# Altium project UNO R4 WiFi.PrjPcb
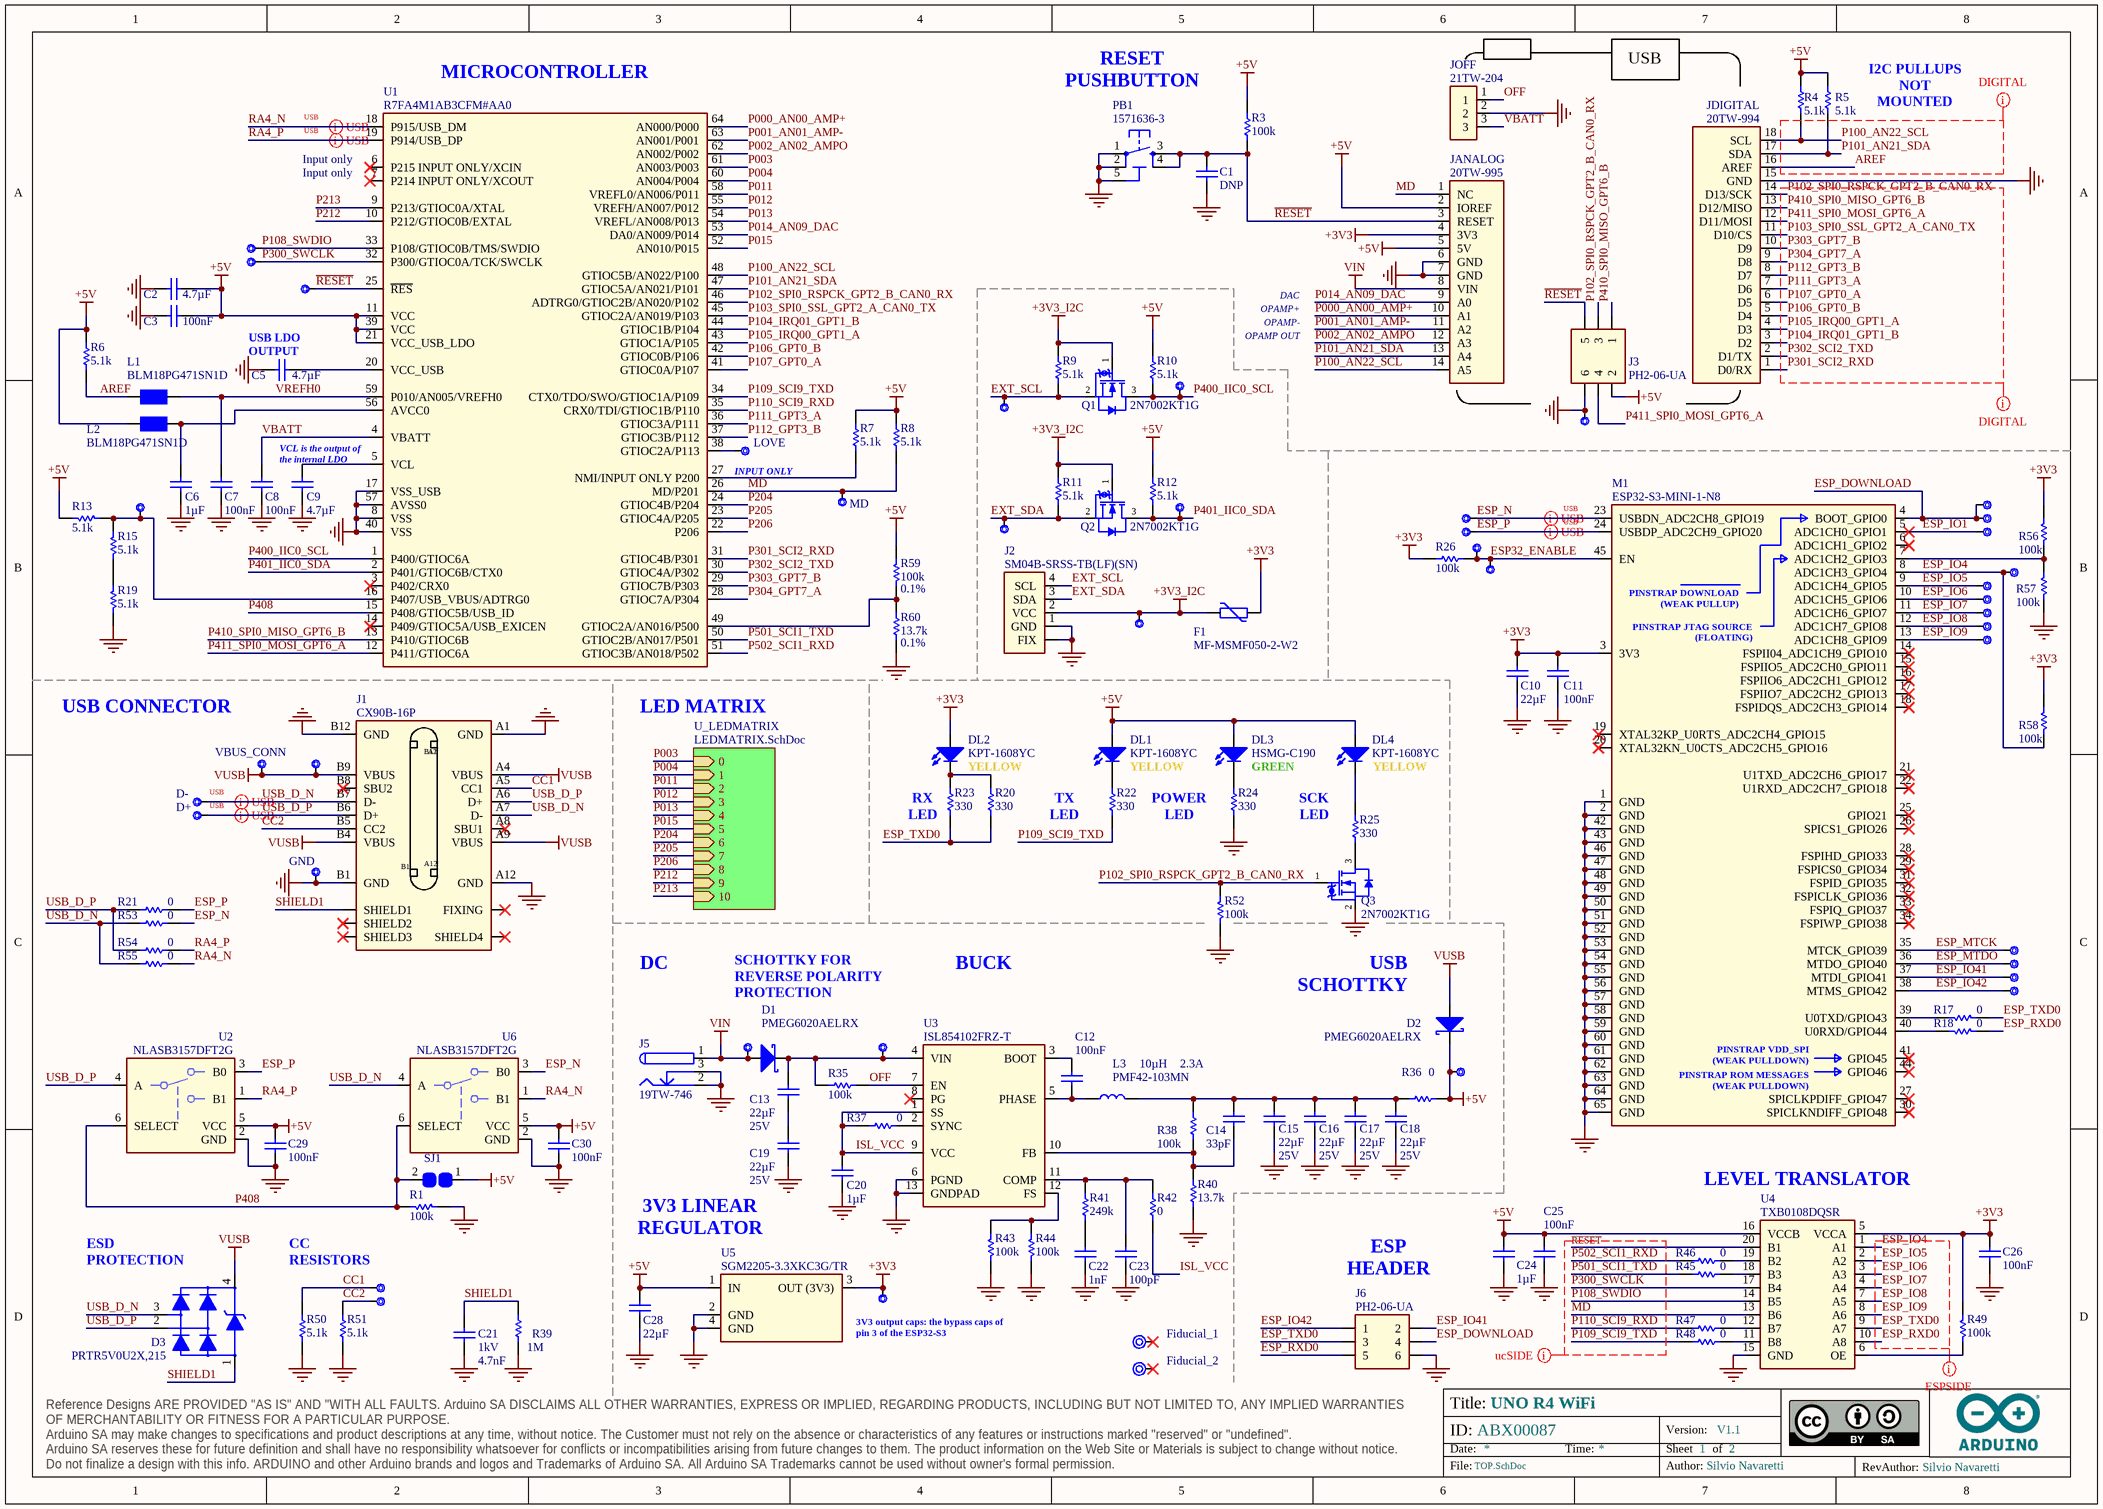
[diagram p0: TOP.SchDoc]
Version: V1.1; VIA_THROUGH_PAD_MM: 0.6; VIA_THROUGH_HOLE_MM: 0.3; VIA_THROUGH: X; VIA_5_PAD_MM: _; VIA_5_HOLE_MM: _; VIA_5: _; VIA_4_PAD_MM: _; VIA_4_HOLE_MM: _; VIA_4: _; VIA_3_PAD_MM: _; VIA_3_HOLE_MM: _; VIA_3: _; VIA_2_PAD_MM: _; VIA_2_HOLE_MM: _; VIA_2: _; VIA_1_PAD_MM: _; VIA_1_HOLE_MM: _; VIA_1: _; TRACK_MIN_WIDTH_OUTER: 0.15mm; TRACK_MIN_WIDTH_INNER: 0.15mm; SKU: ABX00087; PANEL_TABS: _; PANEL_SIZE: 284.7mm x 157.16mm; PANEL_SCORING: X; PANEL_REQUESTED: _; PANEL_PROVIDED: X; PANEL_NUMBER_OF_FIGURES: 10; PANEL_NOT_REQUESTED: _; PANEL_MILLING: X; INSULATION_MIN_OUTER: 0.15mm; INSULATION_MIN_INNER: 0.15mm; FINISH_TBD: _; FINISH_TABS: _; FINISH_SOLDERMASK_TOP: X; FINISH_SOLDERMASK_PEELABLE_TOP: _; FINISH_SOLDERMASK_PEELABLE_COLOR: _; FINISH_SOLDERMASK_PEELABLE_BOTTOM: _; FINISH_SOLDERMASK_COLOR: BLUE; FINISH_SOLDERMASK_BOTTOM: X; FINISH_SN/PB: _; FINISH_SILK_TOP: X; FINISH_SILK_COLOR: WHITE; FINISH_SILK_BOTTOM: X; FINISH_NI/AU: _; FINISH_HAL_LF: _; FINISH_HAL: _; FINISH_ENIG: X; FINISH_EDGE_PLATING: _; FINISH_ADJUSTMENTS: _; DRILLS_SOLDER_FILLING: X; DRILLS_SLOT: _; DRILLS_RESIN_FILLING: _; DRILLS_PRESSFIT: _; DRILLS_LASER: _; DRILLS_FULL: X; DRILLS_COPPER_FILLING: _; DRILLS_BURIED: _; DRILLS_BLIND: _; BOARD_INFO_THICKNESS: 1.6mm; BOARD_INFO_TBD: _; BOARD_INFO_RIGID/FLEX: _; BOARD_INFO_RIGID: X; BOARD_INFO_POLYMIDE: _; BOARD_INFO_PCB_SIZE: 68.58mm x 53.34mm; BOARD_INFO_NUMBER_OF_LAYERS: 4; BOARD_INFO_IPC_NA: X; BOARD_INFO_IPC3: _; BOARD_INFO_IPC2: _; BOARD_INFO_IPC1: _; BOARD_INFO_FR4_HTG: _; BOARD_INFO_FR4: X; BOARD_INFO_FLEX: _; BOARD_INFO_Er: _; BOARD_INFO_AUTHOR: Silvio Navaretti; ASSEMBLY_THT: X; ASSEMBLY_SMD: X; ASSEMBLY_PRESSFIT: _; ASSEMBLY_BGA: _
2 sheets, 257 parts. Net scope: hierarchical (ports join the sheet entries above them; power ports are global).
Board file: PCB.PcbDoc
Sheets:
  TOP.SchDoc
    U_LEDMATRIX = LEDMATRIX.SchDoc

## Sheet TOP.SchDoc: UNO R4 WiFi
size A3; Author: Silvio Navaretti; CompanyName: ARDUINO SRL; DrawnBy: Silvio Navaretti; Engineer: Silvio Navaretti; Organization: ARDUINO SRL; Address1: Via Agostino Da Montefeltro 2 Torino TO, Italy; DocumentNumber: ABX00087; Revision: V1.1; SheetNumber: 1; SheetTotal: 2; RevAuthor: Silvio Navaretti

### Parts
3V3_IC  CMP-018-0004-A.4  [TP-0.8MM]  (value not drawn)  (no BOM)
3V3_TOP  CMP-018-0004-A.4  [TP-0.8MM]  (value not drawn)  (no BOM)
5V_TOP  CMP-018-0004-A.4  [TP-0.8MM]  (value not drawn)  (no BOM)
BUCK_IN_TOP  CMP-018-0004-A.4  [TP-0.8MM]  (value not drawn)  (no BOM)
C1  DNP  [CAP-0402]
C2  value 4.7µF  [CAP-0603]  (hidden comment: GRM188R61C475KAAJD)
C3  value 100nF  [CAP-0402]  (hidden comment: GRM155R61H104KE19D)
C5  value 4.7µF  [CAP-0603]  (hidden comment: GRM188R61C475KAAJD)
C6  value 1µF  [CAP-0402]  (hidden comment: CL05A105KP5NNNC)
C7  value 100nF  [CAP-0402]  (hidden comment: GRM155R61H104KE19D)
C8  value 100nF  [CAP-0402]  (hidden comment: GRM155R61H104KE19D)
C9  value 4.7µF  [CAP-0603]  (hidden comment: GRM188R61C475KAAJD)
C10  value 22µF  [CAP-0805]  (hidden comment: CL21A226MAQNNNE)
C11  value 100nF  [CAP-0402]  (hidden comment: GRM155R61H104KE19D)
C12  value 100nF  [CAP-0402]  (hidden comment: GRM155R61H104KE19D)
C13  value 22µF  Voltage: 25V  [CAP-0805]  (hidden comment: CL21A226MAQNNNE)
C14  value 33pF  [CAP-0402]  (hidden comment: GRM1555C1H330JA01D)
C15  value 22µF  Voltage: 25V  [CAP-0805]  (hidden comment: CL21A226MAQNNNE)
C16  value 22µF  Voltage: 25V  [CAP-0805]  (hidden comment: CL21A226MAQNNNE)
C17  value 22µF  Voltage: 25V  [CAP-0805]  (hidden comment: CL21A226MAQNNNE)
C18  value 22µF  Voltage: 25V  [CAP-0805]  (hidden comment: CL21A226MAQNNNE)
C19  value 22µF  Voltage: 25V  [CAP-0805]  (hidden comment: CL21A226MAQNNNE)
C20  value 1µF  [CAP-0402]  (hidden comment: CL05A105KP5NNNC)
C21  value 4.7nF  Voltage: 1kV  [CAP-0805]  (hidden comment: FV21X472K102ECG)
C22  value 1nF  [CAP-0402]  (hidden comment: GRM155R71H102KA01D)
C23  value 100pF  [CAP-0402]  (hidden comment: CC0402JRNPO9BN101)
C24  value 1µF  [CAP-0402]  (hidden comment: CL05A105KP5NNNC)
C25  value 100nF  [CAP-0402]  (hidden comment: GRM155R61H104KE19D)
C26  value 100nF  [CAP-0402]  (hidden comment: GRM155R61H104KE19D)
C28  value 22µF  [CAP-0805]  (hidden comment: CL21A226MAQNNNE)
C29  value 100nF  [CAP-0402]  (hidden comment: GRM155R61H104KE19D)
C30  value 100nF  [CAP-0402]  (hidden comment: GRM155R61H104KE19D)
CC1  CMP-018-0004-A.4  [TP-0.8MM]  (value not drawn)  (no BOM)
CC2  CMP-018-0004-A.4  [TP-0.8MM]  (value not drawn)  (no BOM)
D1  PMEG6020AELRX  [SOD123-1]
D2  PMEG6020AELRX  [SOD123-1]
D3  PRTR5V0U2X,215  [SOT190P230X110-4N]
D+  CMP-018-0005-A.3  [TP-1.00MM]  (value not drawn)  (no BOM)
D+_TOP  CMP-018-0004-A.4  [TP-0.8MM]  (value not drawn)  (no BOM)
D-  CMP-018-0005-A.3  [TP-1.00MM]  (value not drawn)  (no BOM)
D-_TOP  CMP-018-0004-A.4  [TP-0.8MM]  (value not drawn)  (no BOM)
DL1  KPT-1608YC  [LEDC1608X80N-AK]
DL2  KPT-1608YC  [LEDC1608X80N-AK]
DL3  HSMG-C190  [LEDC1608X80N-AK]
DL4  KPT-1608YC  [LEDC1608X80N-AK]
ESP_DOWNLOAD_BOTTOM1  CMP-018-0005-A.3  [TP-1.00MM]  (value not drawn)  (no BOM)
ESP_DOWNLOAD_TOP  CMP-018-0004-A.4  [TP-0.8MM]  (value not drawn)  (no BOM)
ESP_EN_BOTTOM  CMP-018-0005-A.3  [TP-1.00MM]  (value not drawn)  (no BOM)
ESP_EN_TOP  CMP-018-0004-A.4  [TP-0.8MM]  (value not drawn)  (no BOM)
ESP_IO1  CMP-018-0004-A.4  [TP-0.8MM]  (value not drawn)  (no BOM)
ESP_IO4  CMP-018-0004-A.4  [TP-0.8MM]  (value not drawn)  (no BOM)
ESP_IO5  CMP-018-0004-A.4  [TP-0.8MM]  (value not drawn)  (no BOM)
ESP_IO6  CMP-018-0004-A.4  [TP-0.8MM]  (value not drawn)  (no BOM)
ESP_IO7  CMP-018-0004-A.4  [TP-0.8MM]  (value not drawn)  (no BOM)
ESP_IO8  CMP-018-0004-A.4  [TP-0.8MM]  (value not drawn)  (no BOM)
ESP_IO9  CMP-018-0004-A.4  [TP-0.8MM]  (value not drawn)  (no BOM)
ESP_MTCK  CMP-018-0004-A.4  [TP-0.8MM]  (value not drawn)  (no BOM)
ESP_MTDI  CMP-018-0004-A.4  [TP-0.8MM]  (value not drawn)  (no BOM)
ESP_MTDO  CMP-018-0004-A.4  [TP-0.8MM]  (value not drawn)  (no BOM)
ESP_MTMS  CMP-018-0004-A.4  [TP-0.8MM]  (value not drawn)  (no BOM)
EXT_SCL  CMP-018-0004-A.4  [TP-0.8MM]  (value not drawn)  (no BOM)
EXT_SDA  CMP-018-0004-A.4  [TP-0.8MM]  (value not drawn)  (no BOM)
F1  MF-MSMF050-2-W2  [1812]
Fiducial_1  Fiducial mark 1mm with 2mm solder  [Fiducial mark 1mm with circle-Footprint-1]  (value not drawn)  (no BOM)
Fiducial_2  Fiducial mark 1mm with 2mm solder  [Fiducial mark 1mm with circle-Footprint-1]  (value not drawn)  (no BOM)
GND  CMP-018-0005-A.3  [TP-1.00MM]  (value not drawn)  (no BOM)
GND2  CMP-018-0005-A.3  [TP-1.00MM]  (value not drawn)  (no BOM)
J1  CX90B-16P  [CX90B-16P-Footprint-1]
J2  SM04B-SRSS-TB(LF)(SN)  [SM04B-SRSS-TB(LF)(SN)-Footprint-1]
J3  PH2-06-UA  [2X03]
J5  19TW-746  [POWERSUPPLY_DC-21MM]
J6  PH2-06-UA  [2X03]
JANALOG  20TW-995  [1X14-CUSTOM]
JDIGITAL  20TW-994  [1X18-CUSTOM]
JOFF  21TW-204  [21TW-204]
L1  BLM18PG471SN1D  [L-0603]
L2  BLM18PG471SN1D  [L-0603]
L3  PMF42-103MN  Max DC Current: 2.3A  Inductance: 10µH  [PMF42]
LOVE  CMP-018-0005-A.3  [TP-1.00MM]  (value not drawn)  (no BOM)
M1  ESP32-S3-MINI-1-N8  [ESP32-S3-MINI-1-N8]
MD  CMP-018-0004-A.4  [TP-0.8MM]  (value not drawn)  (no BOM)
P400_SCL  CMP-018-0004-A.4  [TP-0.8MM]  (value not drawn)  (no BOM)
P401_SDA  CMP-018-0004-A.4  [TP-0.8MM]  (value not drawn)  (no BOM)
PB1  1571636-3  [TS42]
Q1  2N7002KT1G  [SOT23]
Q2  2N7002KT1G  [SOT23]
Q3  2N7002KT1G  [SOT23]
R1  value 100k  [RES-0402]  (hidden comment: CRCW0402100KFKEDC)
R3  value 100k  [RES-0402]  (hidden comment: CRCW0402100KFKEDC)
R4  value 5.1k  [RES-0402]  (hidden comment: RC0402FR-075K1L)
R5  value 5.1k  [RES-0402]  (hidden comment: RC0402FR-075K1L)
R6  value 5.1k  [RES-0402]  (hidden comment: RC0402FR-075K1L)
R7  value 5.1k  [RES-0402]  (hidden comment: RC0402FR-075K1L)
R8  value 5.1k  [RES-0402]  (hidden comment: RC0402FR-075K1L)
R9  value 5.1k  [RES-0402]  (hidden comment: RC0402FR-075K1L)
R10  value 5.1k  [RES-0402]  (hidden comment: RC0402FR-075K1L)
R11  value 5.1k  [RES-0402]  (hidden comment: RC0402FR-075K1L)
R12  value 5.1k  [RES-0402]  (hidden comment: RC0402FR-075K1L)
R13  value 5.1k  [RES-0402]  (hidden comment: RC0402FR-075K1L)
R15  value 5.1k  [RES-0402]  (hidden comment: RC0402FR-075K1L)
R17  value 0  [RES-0402]  (hidden comment: CRCW04020000Z0EDC)
R18  value 0  [RES-0402]  (hidden comment: CRCW04020000Z0EDC)
R19  value 5.1k  [RES-0402]  (hidden comment: RC0402FR-075K1L)
R20  value 330  [RES-0402]  (hidden comment: CRCW0402330RJNED)
R21  value 0  [RES-0402]  (hidden comment: CRCW04020000Z0EDC)
R22  value 330  [RES-0402]  (hidden comment: CRCW0402330RJNED)
R23  value 330  [RES-0402]  (hidden comment: CRCW0402330RJNED)
R24  value 330  [RES-0402]  (hidden comment: CRCW0402330RJNED)
R25  value 330  [RES-0402]  (hidden comment: CRCW0402330RJNED)
R26  value 100k  [RES-0402]  (hidden comment: CRCW0402100KFKEDC)
R35  value 100k  [RES-0402]  (hidden comment: CRCW0402100KFKEDC)
R36  value 0  [RES-0402]  (hidden comment: CRCW04020000Z0EDC)
R37  value 0  [RES-0402]  (hidden comment: CRCW04020000Z0EDC)
R38  value 100k  [RES-0402]  (hidden comment: CRCW0402100KFKEDC)
R39  value 1M  [RES-0402]  (hidden comment: CRCW04021M00FKED)
R40  value 13.7k  [RES-0402]  (hidden comment: RC0402FR-0713K7L)
R41  value 249k  [RES-0402]  (hidden comment: AC0402FR-07249KL)
R42  value 0  [RES-0402]  (hidden comment: CRCW04020000Z0EDC)
R43  value 100k  [RES-0402]  (hidden comment: CRCW0402100KFKEDC)
R44  value 100k  [RES-0402]  (hidden comment: CRCW0402100KFKEDC)
R45  value 0  [RES-0402]  (hidden comment: CRCW04020000Z0EDC)
R46  value 0  [RES-0402]  (hidden comment: CRCW04020000Z0EDC)
R47  value 0  [RES-0402]  (hidden comment: CRCW04020000Z0EDC)
R48  value 0  [RES-0402]  (hidden comment: CRCW04020000Z0EDC)
R49  value 100k  [RES-0402]  (hidden comment: CRCW0402100KFKEDC)
R50  value 5.1k  [RES-0402]  (hidden comment: RC0402FR-075K1L)
R51  value 5.1k  [RES-0402]  (hidden comment: RC0402FR-075K1L)
R52  value 100k  [RES-0402]  (hidden comment: CRCW0402100KFKEDC)
R53  value 0  [RES-0402]  (hidden comment: CRCW04020000Z0EDC)
R54  value 0  [RES-0402]  (hidden comment: CRCW04020000Z0EDC)
R55  value 0  [RES-0402]  (hidden comment: CRCW04020000Z0EDC)
R56  value 100k  [RES-0402]  (hidden comment: CRCW0402100KFKEDC)
R57  value 100k  [RES-0402]  (hidden comment: CRCW0402100KFKEDC)
R58  value 100k  [RES-0402]  (hidden comment: CRCW0402100KFKEDC)
R59  value 100k  Tolerance: 0.1%  [RES-0402]  (hidden comment: WF04H1003BT)
R60  value 13.7k  Tolerance: 0.1%  [RES-0402]  (hidden comment: WF04H1372BTL)
RES  CMP-018-0004-A.4  [TP-0.8MM]  (value not drawn)  (no BOM)
SJ1  SMD solder JUMPER 0805  [SJ]  (value not drawn)  (no BOM)
SWCLK  CMP-018-0004-A.4  [TP-0.8MM]  (value not drawn)  (no BOM)
SWDIO  CMP-018-0004-A.4  [TP-0.8MM]  (value not drawn)  (no BOM)
U1  R7FA4M1AB3CFM#AA0  [CQFP50P1200X1200X170-64L]
U2  NLASB3157DFT2G  [TSOP65P210X110-6N]
U3  ISL854102FRZ-T  [QFN0P300X400X100_HS-13L]
U4  TXB0108DQSR  [FP-DQS0020A-MFG]
U5  SGM2205-3.3XKC3G/TR  [SOT223-3]
U6  NLASB3157DFT2G  [TSOP65P210X110-6N]
uC_VBUS  CMP-018-0004-A.4  [TP-0.8MM]  (value not drawn)  (no BOM)
VBUS_CONN  CMP-018-0005-A.3  [TP-1.00MM]  (value not drawn)  (no BOM)
VCONN_TOP  CMP-018-0004-A.4  [TP-0.8MM]  (value not drawn)  (no BOM)
VIN_TOP  CMP-018-0004-A.4  [TP-0.8MM]  (value not drawn)  (no BOM)

### Sub-sheets
U_LEDMATRIX = LEDMATRIX.SchDoc: 0 (in), 1 (in), 2 (in), 3 (in), 4 (in), 5 (in), 6 (in), 7 (in), 8 (in), 9 (in), 10 (in)

### Nets
+3V3: 3V3_TOP.X C10.2 C11.2 C26.2 DL2.A F1.2 JANALOG.4(3V3) M1.3(3V3) R26.1 R49.2 R56.2 R58.2 U4.5(VCCA) U5.3(OUT_(3V3))
+3V3_I2C: 3V3_IC.X F1.1 J2.2(VCC) Q1.1(G) Q2.1(G) R9.1 R11.1
+5V: 5V_TOP.X C2.2 C3.2 C24.2 C25.2 C28.2 C29.2 C30.2 D2.C DL1.A DL3.A DL4.A J3.2 JANALOG.2(IOREF) JANALOG.5(5V) L2.1 R3.2 R4.2 R5.2 R6.2 R7.1 R8.1 R10.1 R12.1 R13.1 R36.2 R59.2 SJ1.1 U1.11(VCC) U1.21(VCC_USB_LDO) U1.39(VCC) U2.5(VCC) U4.16(VCCB) U5.1(IN) U6.5(VCC)
GND: C1.2 C2.1 C3.1 C5.1 C6.2 C7.1 C8.1 C9.1 C10.1 C11.1 C15.1 C16.1 C17.1 C18.1 C19.1 C20.2 C21.1 C22.1 C23.1 C24.1 C25.1 C26.1 C28.1 C29.1 C30.1 GND.X GND2.X J1.A1(GND) J1.A12(GND) J1.B1(GND) J1.B12(GND) J2.1(GND) J2.FIX J3.6 J5.2 J5.3 J6.6 JANALOG.6(GND) JANALOG.7(GND) JDIGITAL.15(GND) JOFF.2 M1.1(GND) M1.2(GND) M1.42(GND) M1.43(GND) M1.46(GND) M1.47(GND) M1.48(GND) M1.49(GND) M1.50(GND) M1.51(GND) M1.52(GND) M1.53(GND) M1.54(GND) M1.55(GND) M1.56(GND) M1.57(GND) M1.58(GND) M1.59(GND) M1.60(GND) M1.61(GND) M1.62(GND) M1.63(GND) M1.64(GND) M1.65(GND) PB1.1 PB1.2 PB1.5(5-GND) Q3.2(S) R1.1 R19.2 R24.1 R39.1 R40.1 R43.1 R44.1 R50.1 R51.1 R52.1 R57.1 R60.1 U1.8(VSS) U1.17(VSS_USB) U1.40(VSS) U1.57(AVSS0) U2.2(GND) U3.6(PGND) U3.13(GNDPAD) U4.15(GND) U5.2(GND) U5.4(GND) U6.2(GND)
VIN: D1.A J5.1 JANALOG.8(VIN) VIN_TOP.X
VUSB: D2.A D3.4 J1.A4(VBUS) J1.A9(VBUS) J1.B4(VBUS) J1.B9(VBUS) VBUS_CONN.X VCONN_TOP.X
AREF: JDIGITAL.16(AREF) L1.1 R6.1  [project net AREF_1]
CC1: CC1.X J1.A5(CC1) R50.2  [project net CC1_1]
CC2: CC2.X J1.B5(CC2) R51.2  [project net CC2_1]
ESP32_ENABLE: ESP_EN_BOTTOM.X ESP_EN_TOP.X M1.45(EN) R26.2  [project net ESP32_ENABLE_1]
ESP_DOWNLOAD: ESP_DOWNLOAD_BOTTOM1.X ESP_DOWNLOAD_TOP.X J6.4 M1.4(BOOT_GPIO0)  [project net ESP_DOWNLOAD_1]
ESP_IO1: ESP_IO1.X M1.5(ADC1CH0_GPIO1)  [project net ESP_IO1_1]
ESP_IO4: ESP_IO4.X M1.8(ADC1CH3_GPIO4) R58.1 U4.1(A1)  [project net ESP_IO4_1]
ESP_IO5: ESP_IO5.X M1.9(ADC1CH4_GPIO5) U4.2(A2)  [project net ESP_IO5_1]
ESP_IO6: ESP_IO6.X M1.10(ADC1CH5_GPIO6) U4.3(A3)  [project net ESP_IO6_1]
ESP_IO7: ESP_IO7.X M1.11(ADC1CH6_GPIO7) U4.4(A4)  [project net ESP_IO7_1]
ESP_IO8: ESP_IO8.X M1.12(ADC1CH7_GPIO8) U4.7(A5)  [project net ESP_IO8_1]
ESP_IO9: ESP_IO9.X M1.13(ADC1CH8_GPIO9) U4.8(A6)  [project net ESP_IO9_1]
ESP_IO41: ESP_MTDI.X J6.2 M1.37(MTDI_GPIO41)  [project net ESP_IO41_1]
ESP_IO42: ESP_MTMS.X J6.1 M1.38(MTMS_GPIO42)  [project net ESP_IO42_1]
ESP_MTCK: ESP_MTCK.X M1.35(MTCK_GPIO39)  [project net ESP_MTCK_1]
ESP_MTDO: ESP_MTDO.X M1.36(MTDO_GPIO40)  [project net ESP_MTDO_1]
ESP_N: D-_TOP.X M1.23(USBDN_ADC2CH8_GPIO19) R53.1 U6.3(B0)  [project net ESP_N_1]
ESP_P: D+_TOP.X M1.24(USBDP_ADC2CH9_GPIO20) R21.1 U2.3(B0)  [project net ESP_P_1]
ESP_RXD0: J6.5 R18.1 U4.10(A8)  [project net ESP_RXD0_1]
ESP_TXD0: J6.3 R17.1 R20.1 R23.1 U4.9(A7)  [project net ESP_TXD0_1]
EXT_SCL: EXT_SCL.X J2.4(SCL) Q1.2(S) R9.2  [project net EXT_SCL_1]
EXT_SDA: EXT_SDA.X J2.3(SDA) Q2.2(S) R11.2  [project net EXT_SDA_1]
ISL_VCC: C20.1 R37.2 R42.2 U3.1(SS) U3.9(VCC)  [project net ISL_VCC_1]
MD: JANALOG.1(NC) MD.X R8.2 U1.26(MD/P201) U4.13(B6)  [project net MD_1]
OFF: JOFF.1 R35.2 U3.7(EN)  [project net OFF_1]
P000_AN00_AMP+: JANALOG.10(A1) U1.64(AN000/P000)  [project net P000_AN00_AMP+_1]
P001_AN01_AMP-: JANALOG.11(A2) U1.63(AN001/P001)  [project net P001_AN01_AMP-_1]
P002_AN02_AMPO: JANALOG.12(A3) U1.62(AN002/P002)  [project net P002_AN02_AMPO_1]
P003: U1.61(AN003/P003) ; sheet U_LEDMATRIX/0
P004: U1.60(AN004/P004) ; sheet U_LEDMATRIX/1
P011: U1.58(VREFL0/AN006/P011) ; sheet U_LEDMATRIX/2
P012: U1.55(VREFH/AN007/P012) ; sheet U_LEDMATRIX/3
P013: U1.54(VREFL/AN008/P013) ; sheet U_LEDMATRIX/4
P014_AN09_DAC: JANALOG.9(A0) U1.53(DA0/AN009/P014)  [project net P014_AN09_DAC_1]
P015: U1.52(AN010/P015) ; sheet U_LEDMATRIX/5
P100_AN22_SCL: JANALOG.14(A5) JDIGITAL.18(SCL) R4.1 U1.48(GTIOC5B/AN022/P100)  [project net P100_AN22_SCL_1]
P101_AN21_SDA: JANALOG.13(A4) JDIGITAL.17(SDA) R5.1 U1.47(GTIOC5A/AN021/P101)  [project net P101_AN21_SDA_1]
P102_SPI0_RSPCK_GPT2_B_CAN0_RX: J3.3 JDIGITAL.14(D13/SCK) Q3.1(G) R52.2 U1.46(ADTRG0/GTIOC2B/AN020/P102)  [project net P102_SPI0_RSPCK_GPT2_B_CAN0_RX_1]
P103_SPI0_SSL_GPT2_A_CAN0_TX: JDIGITAL.11(D10/CS) U1.45(GTIOC2A/AN019/P103)  [project net P103_SPI0_SSL_GPT2_A_CAN0_TX_1]
P104_IRQ01_GPT1_B: JDIGITAL.3(D2) U1.44(GTIOC1B/P104)  [project net P104_IRQ01_GPT1_B_1]
P105_IRQ00_GPT1_A: JDIGITAL.4(D3) U1.43(GTIOC1A/P105)  [project net P105_IRQ00_GPT1_A_1]
P106_GPT0_B: JDIGITAL.5(D4) U1.42(GTIOC0B/P106)  [project net P106_GPT0_B_1]
P107_GPT0_A: JDIGITAL.6(D5) U1.41(GTIOC0A/P107)  [project net P107_GPT0_A_1]
P108_SWDIO: SWDIO.X U1.33(P108/GTIOC0B/TMS/SWDIO) U4.14(B5)  [project net P108_SWDIO_1]
P109_SCI9_TXD: R22.1 R48.1 U1.34(CTX0/TDO/SWO/GTIOC1A/P109)  [project net P109_SCI9_TXD_1]
P110_SCI9_RXD: R47.1 U1.35(CRX0/TDI/GTIOC1B/P110)  [project net P110_SCI9_RXD_1]
P111_GPT3_A: JDIGITAL.7(D6) U1.36(GTIOC3A/P111)  [project net P111_GPT3_A_1]
P112_GPT3_B: JDIGITAL.8(D7) U1.37(GTIOC3B/P112)  [project net P112_GPT3_B_1]
P204: U1.24(GTIOC4B/P204) ; sheet U_LEDMATRIX/6
P205: U1.23(GTIOC4A/P205) ; sheet U_LEDMATRIX/7
P206: U1.22(P206) ; sheet U_LEDMATRIX/8
P212: U1.10(P212/GTIOC0B/EXTAL) ; sheet U_LEDMATRIX/9
P213: U1.9(P213/GTIOC0A/XTAL) ; sheet U_LEDMATRIX/10
P300_SWCLK: SWCLK.X U1.32(P300/GTIOC0A/TCK/SWCLK) U4.17(B4)  [project net P300_SWCLK_1]
P301_SCI2_RXD: JDIGITAL.1(D0/RX) U1.31(GTIOC4B/P301)  [project net P301_SCI2_RXD_1]
P302_SCI2_TXD: JDIGITAL.2(D1/TX) U1.30(GTIOC4A/P302)  [project net P302_SCI2_TXD_1]
P303_GPT7_B: JDIGITAL.10(D9) U1.29(GTIOC7B/P303)  [project net P303_GPT7_B_1]
P304_GPT7_A: JDIGITAL.9(D8) U1.28(GTIOC7A/P304)  [project net P304_GPT7_A_1]
P400_IIC0_SCL: P400_SCL.X Q1.3(D) R10.2 U1.1(P400/GTIOC6A)  [project net P400_IIC0_SCL_1]
P401_IIC0_SDA: P401_SDA.X Q2.3(D) R12.2 U1.2(P401/GTIOC6B/CTX0)  [project net P401_IIC0_SDA_1]
P408: R1.2 SJ1.2 U1.15(P408/GTIOC5B/USB_ID) U2.6(SELECT) U6.6(SELECT)  [project net P408_1]
P410_SPI0_MISO_GPT6_B: J3.1 JDIGITAL.13(D12/MISO) U1.13(P410/GTIOC6B)  [project net P410_SPI0_MISO_GPT6_B_1]
P411_SPI0_MOSI_GPT6_A: J3.4 JDIGITAL.12(D11/MOSI) U1.12(P411/GTIOC6A)  [project net P411_SPI0_MOSI_GPT6_A_1]
P501_SCI1_TXD: R45.1 U1.50(GTIOC2B/AN017/P501)  [project net P501_SCI1_TXD_1]
P502_SCI1_RXD: R46.1 U1.51(GTIOC3B/AN018/P502)  [project net P502_SCI1_RXD_1]
~{RESET}: C1.1 J3.5 JANALOG.3(RESET) PB1.3 PB1.4 R3.1 RES.X U1.25(~{RES}) U4.20(B1)  [project net ~{RESET}_1]
RA4_N: R55.1 U1.18(P915/USB_DM) U6.1(B1)  [project net RA4_N_1]
RA4_P: R54.1 U1.19(P914/USB_DP) U2.1(B1)  [project net RA4_P_1]
SHIELD1: C21.2 D3.1 J1.SHIELD1 R39.2  [project net SHIELD1_1]
USB_D_N: D3.3 D-.X J1.A7(D-) J1.B7(D-) R53.2 R55.2 U6.4(A)  [project net USB_D_N_1]
USB_D_P: D3.2 D+.X J1.A6(D+) J1.B6(D+) R21.2 R54.2 U2.4(A)  [project net USB_D_P_1]
VBATT: C8.2 JOFF.3 U1.4(VBATT)  [project net VBATT_1]
VREFH0: C7.2 L1.2 U1.59(P010/AN005/VREFH0)  [project net VREFH0_1]
NetBUCK_IN_TOP_X: BUCK_IN_TOP.X C13.2 D1.C R35.1 U3.4(VIN)
NetC5_2: C5.2 U1.20(VCC_USB)
NetC6_1: C6.1 L2.2 U1.56(AVCC0)
NetC9_2: C9.2 U1.5(VCL)
NetC12_1: C12.1 L3.1 U3.5(PHASE)
NetC12_2: C12.2 U3.3(BOOT)
NetC13_1: C13.1 C19.2
NetC14_1: C14.1 R38.2 R40.2 U3.10(FB)
NetC14_2: C14.2 C15.2 C16.2 C17.2 C18.2 L3.2 R36.1 R38.1
NetC22_2: C22.2 R41.1
NetC23_2: C23.2 R41.2 R42.1 U3.11(COMP)
NetDL1_C: DL1.C R22.2
NetDL2_C: DL2.C R20.2 R23.2
NetDL3_C: DL3.C R24.2
NetDL4_C: DL4.C R25.2
NetLOVE_X: LOVE.X U1.38(GTIOC2A/P113)
NetM1_7: M1.7(ADC1CH2_GPIO3) R56.1 R57.2
NetM1_39: M1.39(U0TXD/GPIO43) R17.2
NetM1_40: M1.40(U0RXD/GPIO44) R18.2
NetQ3_3: Q3.3(D) R25.1
NetR7_2: R7.2 U1.27(NMI/INPUT_ONLY_P200)
NetR13_2: R13.2 R15.2 U1.16(P407/USB_VBUS/ADTRG0) uC_VBUS.X
NetR15_1: R15.1 R19.1
NetR37_1: R37.1 U3.2(SYNC)
NetR43_2: R43.2 R44.2 U3.12(FS)
NetR45_2: R45.2 U4.18(B3)
NetR46_2: R46.2 U4.19(B2)
NetR47_2: R47.2 U4.12(B7)
NetR48_2: R48.2 U4.11(B8)
NetR49_1: R49.1 U4.6(OE)
NetR59_1: R59.1 R60.2 U1.49(GTIOC2A/AN016/P500)

Not connected (* = marked no-connect by the designer): Fiducial_1 1*; Fiducial_2 1*; J1 A8(SBU1)* B8(SBU2)* FIXING* SHIELD2* SHIELD3* SHIELD4*; M1 6(ADC1CH1_GPIO2)* 14(FSPII04_ADC1CH9_GPIO10)* 15(FSPIIO5_ADC2CH0_GPIO11)* 16(FSPIIO6_ADC2CH1_GPIO12)* 17(FSPIIO7_ADC2CH2_GPIO13)* 18(FSPIDQS_ADC2CH3_GPIO14)* 19(XTAL32KP_U0RTS_ADC2CH4_GPIO15)* 20(XTAL32KN_U0CTS_ADC2CH5_GPIO16)* 21(U1TXD_ADC2CH6_GPIO17)* 22(U1RXD_ADC2CH7_GPIO18)* 25(GPIO21)* 26(SPICS1_GPIO26)* 27(SPICLKPDIFF_GPIO47)* 28(FSPIHD_GPIO33)* 29(FSPICS0_GPIO34)* 30(SPICLKNDIFF_GPIO48)* 31(FSPID_GPIO35)* 32(FSPICLK_GPIO36)* 33(FSPIQ_GPIO37)* 34(FSPIWP_GPIO38)* 41(GPIO45)* 44(GPIO46)*; U1 3(P402/CRX0)* 6(P215_INPUT_ONLY/XCIN)* 7(P214_INPUT_ONLY/XCOUT)* 14(P409/GTIOC5A/USB_EXICEN)*; U3 8(PG)*

### Layout directives
net class ucSIDE: MD, P108_SWDIO, P109_SCI9_TXD, P110_SCI9_RXD, P300_SWCLK, P501_SCI1_TXD, P502_SCI1_RXD, ~{RESET}
net class DIGITAL: AREF, P100_AN22_SCL, P101_AN21_SDA, P102_SPI0_RSPCK_GPT2_B_CAN0_RX, P103_SPI0_SSL_GPT2_A_CAN0_TX, P104_IRQ01_GPT1_B, P105_IRQ00_GPT1_A, P106_GPT0_B, P107_GPT0_A, P111_GPT3_A, P112_GPT3_B, P301_SCI2_RXD, P302_SCI2_TXD, P303_GPT7_B, P304_GPT7_A, P410_SPI0_MISO_GPT6_B, P411_SPI0_MOSI_GPT6_A
differential pair; differential pair class USB: ESP_N_1, ESP_P_1, RA4_N_1, RA4_P_1, USB_D_N_1, USB_D_P_1
net class espSIDE: ESP_IO4, ESP_IO5, ESP_IO6, ESP_IO7, ESP_IO8, ESP_IO9, ESP_RXD0, ESP_TXD0

### Notes on the sheet
- (near U1) MICROCONTROLLER
- (near R3) RESET PUSHBUTTON
- USB
- (near R5) I2C PULLUPS
  NOT MOUNTED
- (near U1) Input only
- DAC
- OPAMP+
- (near C5) USB LDO OUTPUT
- OPAMP-
- OPAMP OUT
- VCL is the output of the internal LDO
- (near LOVE) INPUT ONLY
- (near VBUS_CONN) USB CONNECTOR
- (near U1) LED MATRIX
- YELLOW
- GREEN
- (near DL4) YELLOW
- (near R23) RX LED
- TX LED
- (near R24) POWER LED
- (near R25) SCK LED
- DC JACK
- BUCK CONVERTER
- SCHOTTKY FOR REVERSE POLARITY PROTECTION
- USB SCHOTTKY
- LEVEL TRANSLATOR
- 3V3 LINEAR REGULATOR
- (near D3) ESD
  PROTECTION
- (near CC1) CC RESISTORS
- ESP HEADER
- 3V3 output caps: the bypass caps of pin 3 of the ESP32-S3
- Title:
- ID:
- Date:
- Time:
- Version:
- Sheet
- of
- RevAuthor:
- Reference Designs ARE PROVIDED "AS IS" AND "WITH ALL FAULTS. Arduino SA DISCLAIMS ALL OTHER WARRANTIES, EXPRESS OR IMPLIED, REGARDING PRODUCTS, INCLUDING BUT NOT LIMITED TO, ANY IMPLIED WARRANTIES OF MERCHANTABILITY OR FITNESS FOR A PARTICULAR PURPOSE.
  Arduino SA may make changes to specifications and product descriptions at any time, without notice. The Customer must not rely on the absence or characteristics of any features or instructions marked "reserved" or "undefined".
  Arduino SA reserves these for future definition and shall have no responsibility whatsoever for conflicts or incompatibilities arising from future changes to them. The product information on the Web Site or Materials is subject to change without notice.
  Do not finalize a design with this info. ARDUINO and other Arduino brands and logos and Trademarks of Arduino SA. All Arduino SA Trademarks cannot be used without owner's formal permission.
- File:
- Author:
- (in symbol M0017-A.7) PINSTRAP DOWNLOAD / (WEAK PULLUP); PINSTRAP JTAG SOURCE / (FLOATING); PINSTRAP VDD_SPI / (WEAK PULLDOWN); PINSTRAP ROM MESSAGES / (WEAK PULLDOWN)

### Library data of the parts
3V3_IC 3V3_TOP 5V_TOP BUCK_IN_TOP CC1 CC2 D+_TOP D-_TOP ESP_DOWNLOAD_TOP ESP_EN_TOP ESP_IO1 ESP_IO4-ESP_IO9 ESP_MTCK ESP_MTDI ESP_MTDO ESP_MTMS EXT_SCL EXT_SDA MD P400_SCL P401_SDA RES SWCLK SWDIO uC_VBUS VCONN_TOP VIN_TOP = UT0012-A.4: Test point 0.8mm; Design Item ID: CMP-018-0004-A.4; Source: ut.SchLib; Pin Count: 1
C1 = UT0021-A.3: Package: 0402; Part Number: DNP
C2 C5 C9 = C0054-A.16: CAP CHIP 0603 4.7uF 10% 16V X5R; Manufacturer: Murata; Code Arduino: A5072; Tolerance: 10%; Case Code (Imperial): 0603; Voltage: 16V; Manufacturer 2: Murata; Part Number: GRM188R61C475KAAJD; Dielectric: X5R; Technology: Ceramic; Part number 3: CL10A475KO8NNNC; Part number 2: GRM188R61C475KE11D; Manufacturer 3: Samsung Electro-Mechanics
C3 C7 C8 C11 C12 C25 C26 C29 C30 = C0015-A.14: CAP CHIP 0402 100nF 10% 50V X5R; Manufacturer: Murata; Code Arduino: A5141; Tolerance: 10%; Case Code (Imperial): 0402; Dielectric: X5R; Voltage: 50V; Part Number: GRM155R61H104KE19D; Technology: Ceramic
C6 C20 C24 = C0017-A.14: CAP CHIP 0402 1uF 10% 10V X5R; Manufacturer: Samsung Electro-Mechanics; Code Arduino: 0133; Manufacturer 2: Murata Electronics; Tolerance: 10%; Part Number: CL05A105KP5NNNC; Dielectric: X5R; Voltage: 10V; Case Code (Imperial): 0402; Technology: Ceramic; Part number 2: GCM155C71A105KE38D
C10 C13 C15-C19 C28 = C0111-A.7: CAP CHIP 0805 22uF 20% 25V X5R; Manufacturer: Samsung Electro-Mechanics; Code Arduino: C0111; Case Code (Imperial): 0805; Tolerance: 20%; Dielectric: X5R; Part Number: CL21A226MAQNNNE; Technology: Ceramic
  C10 C28: Voltage: 25V
C14 = C0034-A.14: CAP CHIP 0402 33pF 5% 50V C0G; Manufacturer: Murata; Code Arduino: A5494; Dielectric: C0G; Voltage: 50V; Tolerance: 5%; Part Number: GRM1555C1H330JA01D; Case Code (Imperial): 0402; Technology: Ceramic
C21 = C0059-A.14: CAP CHIP 0805 4.7nF 10% 1000V X7R; Manufacturer: PSA Shenzen; Code Arduino: 0689; Manufacturer 2: KEMET; Tolerance: 10%; Case Code (Imperial): 0805; Part Number: FV21X472K102ECG; Dielectric: X7R; Part number 2: C0805V472KDRACTU; Part number 3: C0805C472KDRACTU; Manufacturer 3: KEMET; Technology: Ceramic
C22 = C0007-A.15: CAP CHIP 0402 1nF 10% 50V X7R; Manufacturer: KEMET; Code Arduino: 2321; Tolerance: 10%; Case Code (Imperial): 0402; Dielectric: X7R; Voltage: 50V; Part Number: GRM155R71H102KA01D; Technology: Ceramic
C23 = C0013-A.4: CAP CHIP 0402 100pF 10% 50V C0G; Manufacturer: Yageo; Code Arduino: C0013; Tolerance: 5%; Case Code (Imperial): 0402; Dielectric: C0G; Part Number: CC0402JRNPO9BN101; Voltage: 50V; Technology: Ceramic
D1 D2 = D0026-A.6: DIODE SCHOTTKY SMD 2A 60V SOD123FL; Manufacturer: Nexperia; Manucturer Part Number 2: SS26L; Code Arduino: 2208; Forward Voltage: 0.6V; Manucturer 2: Hottech; RoHS Compliance: RoHS3; Part Number: PMEG6020AELRX; Device Type: Diode Schottky; Forward Current: 2A
D3 = D0025-A.5: TVS ARRAY 4LIN.8kV 1pF SOT143B; Manufacturer: Nexperia; Device Type: ESD protection; Code Arduino: 2209; Part Number: PRTR5V0U2X,215
D+ D- ESP_DOWNLOAD_BOTTOM1 ESP_EN_BOTTOM GND GND2 LOVE VBUS_CONN = UT0013-A.4: Test point 1.00mm; Source: ut.SchLib; Design Item ID: CMP-018-0005-A.3; Pin Count: 1
DL1 DL2 DL4 = L0008-A.5: LED SMD 0603 GIA588   8mcd 120^; Manufacturer: Kingbright; Code Arduino: 2243; Part Number: KPT-1608YC; Pin Count: 2
DL3 = L0009-A.5: LED SMD 0603 GREEN/568 15mcd 120^; Manufacturer: Broadcom; Code Arduino: 2204; Part Number: HSMG-C190; Pin Count: 2
F1 = P0002-A.7: PTC RESET FUSE 15V 500MA 1812 LOGO OO ARDUINO; Manufacturer: Bourns; Approvals: UL,CSA,TUV; Time to Trip: 0.15s; Max Current Rating: 100A; Trip Current: 1A; Resistance: 150mR; Code Arduino: 3335; Power Dissipation: 800mW; Part Number: MF-MSMF050-2-W2; Hold Current: 500mA; Operating Supply Voltage: 15V; Contact Plating: Gold; Case Code (Metric): 4532; Min Operating Temperature: -40°C; Packaging: Tape and Reel; Max Operating Temperature: 85°C; Radiation Hardening: No; Voltage Rating (DC): 15V; Termination: SMD/SMT; Number of Terminals: 2; Terminal Material: Gold; Voltage Rating: 15V; Width: 3.41mm; Case Code (Imperial): 1812; Length: 4.73mm; Current Rating: 100A; REACH SVHC: No SVHC; Package Quantity: 2000; Lead Free: Lead Free; Case/Package: 1812; Height: 0.85mm; Mount: Surface Mount,PCB
Fiducial_1 Fiducial_2 = UT0024-A.6
J1 = J0272-A.3: CONN RCPT USB3.1 TYPEC 16POS SMD; Manufacturer: Hirose; Code Arduino: J0272; Part Number: CX90B-16P
J2 = J0005-A.2: CONN JST 4POS SIDE 1MM TIN QWIIC; Code Arduino: J0005; Part Number: SM04B-SRSS-TB(LF)(SN); Manufacturer: JST
J3 J6 = J0004-A.5: CONN Header Through Hole 6 position 0.100" (2.54mm); Manufacturer: Adam Tech; Code Arduino: 0114; Part Number: PH2-06-UA
J5 = J0236-A.5: CONN PWR JACK 2.1X5.5MM SOLDER; Manufacturer: 4UCON; Code Arduino: 0018; Part Number: 19TW-746
JANALOG = J0063-A.7: CONN STRIP F/1/D 14v SER.NERA s1pin; Manufacturer: 4UCONN; Code Arduino: 3649; Part Number: 20TW-995; Pin Count: 14
JDIGITAL = J0035-A.10: CONN STRIP F/1/D 18v SER.NERA s1pin; Manufacturer: 4UCONN; Code Arduino: 3648; Part Number: 20TW-994
JOFF = J0184-A.7: CONN HEADER VERT 3POS 2.54MM; Manufacturer: 4UCONN; Number of Contacts: 3; Insulation Resistance: 1GR; Connector Type: BOARD CONNECTOR; Contact Resistance: 20mR; Code Arduino: J0184; Max Operating Temperature: 125°C; Min Operating Temperature: -40°C; Termination: Solder; Contact Material: Copper Alloy; Insulation Color: Black; Mount: Board; Part Number: 21TW-204
L1 L2 = I0006-A.5: FERRITE SMD 0603 470R 1A 0.2R; Manufacturer: Murata; Test Frequency: 100MHz; Code Arduino: 2200; Tolerance: 25%; DC Resistance (DCR): 200mR; Part Number: BLM18PG471SN1D; Case Code (Imperial): 0603; Max DC Current: 1A; Min Operating Temperature: -55°C; Case Code (Metric): 1608; Package Quantity: 1; Current: 1A; Device Type: Ferrite; Max Operating Temperature: 125°C; Packaging: Tape and Reel
L3 = I0072-A.3: IND 10uH 20%, max 235mR, IDC 2.3A, Isat 2.3A, shielded, max 5MHz, 4.5x4.5x1.8mm; Manufacturer: K-WELL; DC Resistance (DCR): 235m; Code Arduino: I0072; Part Number: PMF42-103MN; Current: 2.3A; Frequency: 5MHz; Tolerance: 20%
M1 = M0017-A.7: MODULE ESP32-S3 dual core 32b Xtensa LX7, WiFi 2.4GHz, BLE 5 LE, internal 8MB QSPI flash, no internal PSRAM, PCB antenna, max 85°C, 15.4x20.5x2.4mm; Manufacturer: Espressif; Code Arduino: M0017; Part Number: ESP32-S3-MINI-1-N8
PB1 = B0005-A.8: PUSHBUTTON SMD 6x6 5 PINS; Manufacturer: TE Connectivity; Code Arduino: 0946; Part Number: 1571636-3; Manufacturer Part Number 2: TS42031-160WWS027260; Manufacturer 2: C&K
Q1-Q3 = T0004-A.7: MOSFET N-CH 60V 300mA ESD prot. SOT23; Manufacturer: On Semiconductor; Device Type: Mosfet N-CH SMD; Code Arduino: A5393; Manufacturer 2: Hottech; Pin Count: 3; Manufacturer Part Number 2: 2N7002K; Part Number: 2N7002KT1G
R1 R3 R43 R44 R49 R52 R56-R58 = R0001-A.23: RES CHIP 0402 100k 1% 1/16W; Manufacturer: Vishay; Code Arduino: 0134; Power: 62.5mW; Temperature coefficient: 100ppm; Part Number: CRCW0402100KFKEDC; Tolerance: 1%; Case Code (Imperial): 0402; Technology: Thick film
R4-R13 R15 R19 = R0210-A.18: RES CHIP 0402 5k1 1% 1/16W; Manufacturer: YAGEO; Power: 63mW; Code Arduino: R0210; Temperature coefficient: 100ppm; Tolerance: 1%; Part Number: RC0402FR-075K1L; Case Code (Imperial): 0402; Technology: Thick film
R17 R18 R21 R37 R42 R45-R48 R53-R55 = R0000-A.23: RES CHIP 0402 0R 1/16W; Manufacturer: Vishay; Code Arduino: 0039; Power: 62.5mW; Tolerance: 0%; Temperature coefficient: 0ppm; Case Code (Imperial): 0402; Part Number: CRCW04020000Z0EDC; Technology: Thick film
R20 R22-R25 = R0017-A.23: RES CHIP 0402 330R 5% 1/16W; Manufacturer: Vishay; Code Arduino: 2229; Power: 62.5mW; Temperature coefficient: 200ppm; Part Number: CRCW0402330RJNED; Tolerance: 5%; Case Code (Imperial): 0402; Technology: Thick film
R26 R35 R38 = R0001-A.23: RES CHIP 0402 100k 1% 1/16W; Manufacturer: Vishay; Power: 62.5mW; Code Arduino: 0134; Temperature coefficient: 100ppm; Case Code (Imperial): 0402; Tolerance: 1%; Part Number: CRCW0402100KFKEDC; Technology: Thick film
R36 = R0000-A.23: RES CHIP 0402 0R 1/16W; Manufacturer: Vishay; Code Arduino: 0039; Tolerance: 0%; Power: 62.5mW; Temperature coefficient: 0ppm; Part Number: CRCW04020000Z0EDC; Case Code (Imperial): 0402; Technology: Thick film
R39 = R0058-A.23: RES CHIP 0402 1M 1% 1/16W; Manufacturer: Vishay; Power: 62.5mW; Code Arduino: 0139; Temperature coefficient: 100ppm; Case Code (Imperial): 0402; Tolerance: 1%; Part Number: CRCW04021M00FKED; Technology: Thick film
R40 = R0233-A.9: RES CHIP 0402 13k7 1% 1/16W; Manufacturer: YAGEO; Power: 62.5mW; Code Arduino: R0233; Temperature coefficient: 100ppm; Tolerance: 1%; Part Number: RC0402FR-0713K7L; Case Code (Imperial): 0402; Technology: Thick film
R41 = R0234-A.8: RES CHIP 0402 249k 1% 1/16W; Manufacturer: YAGEO; Code Arduino: R0234; Power: 62.5mW; Temperature coefficient: 100ppm; Tolerance: 1%; Part Number: AC0402FR-07249KL; Case Code (Imperial): 0402; Technology: Thick film
R50 R51 = R0210-A.18: RES CHIP 0402 5k1 1% 1/16W; Manufacturer: YAGEO; Code Arduino: R0210; Power: 63mW; Temperature coefficient: 100ppm; Part Number: RC0402FR-075K1L; Tolerance: 1%; Case Code (Imperial): 0402; Technology: Thick film
R59 = R0247-A.4: RES CHIP 0402 100k 0.1% 100ppm 1/16W; Manufacturer: Walsin; Code Arduino: R0247; Power: 62.5mW; Part Number: WF04H1003BT; Case Code (Imperial): 0402; Temperature coefficient: 100ppm; Technology: Thick film
R60 = R0248-A.3: RES CHIP 0402 13k7 0.1% 100PPM 1/16W; Manufacturer: Walsin; Power: 62.5mW; Code Arduino: R0248; Temperature coefficient: 200ppm; Part Number: WF04H1372BTL; Case Code (Imperial): 0402; Technology: Thick film
SJ1 = UT0002-A.5: Solder Jumper 0805 THIS IS NOT A COMPONENT; Code Arduino: This is not a component
U1 = U0274-A.7: IC uC RA4M1 32b M4 48MHz 254KB flash 32KB RAM 105°C LQFP64 10x10mm; Manufacturer: Renesas; Code Arduino: U0274; Part Number: R7FA4M1AB3CFM#AA0
U2 U6 = U0174-A.2: IC SPDT,max 25R at VCC 4.5V tPD 1.2ns VCC 1.65V to 5V Iq max 10uA SOT363; Manufacturer: ON Semiconductor; Code Arduino: U0174; Part Number: NLASB3157DFT2G
U3 = U0275-A.5: IC BUCK Vin 40V Iout 1.2A 2MHz 12DFN 3x4mm; Manufacturer: Renesas; Code Arduino: U0275; Part Number: ISL854102FRZ-T
U4 = U0276-A.5: IC TRANSLATOR LEVEL SHIFTER BIDIR 8BIT 20SON; Manufacturer: Texas Instruments; Code Arduino: U0276; Part Number: TXB0108DQSR
U5 = U0289-A.2: IC LINEAR REGULATOR Vout 3V3 fixed Vin max 20V Iout max 800mA Pd 1.32W; Manufacturer: SGMICRO; Code Arduino: U0289; Part Number: SGM2205-3.3XKC3G/TR

## Sheet LEDMATRIX.SchDoc: LED MATRIX
size A4; Author: Silvio Navaretti; CompanyName: ARDUINO SRL; DrawnBy: Silvio Navaretti; Engineer: Silvio Navaretti; Organization: ARDUINO SRL; DocumentNumber: ABX00087; Revision: V1.1; SheetNumber: 2; SheetTotal: 2; RevAuthor: Silvio Navaretti
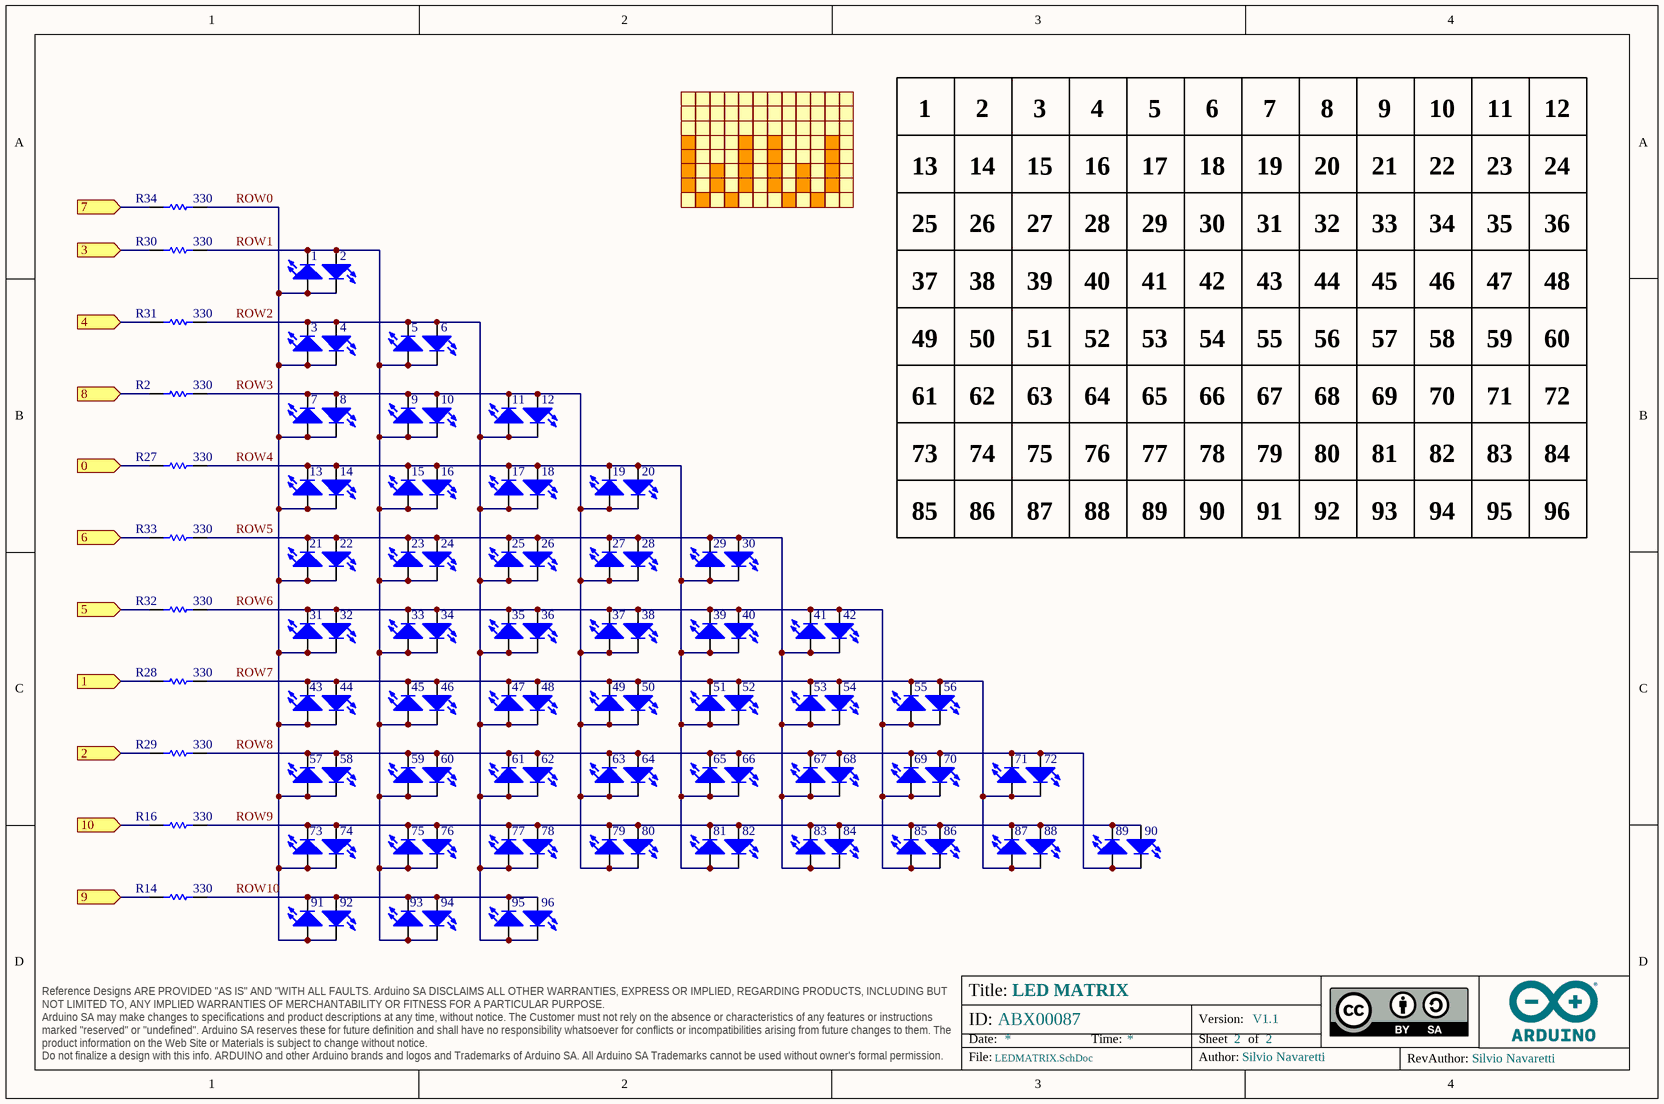
[diagram p1: LEDMATRIX.SchDoc]

### Parts
1  XHY-STB0603SR  [LEDC1608X80N-AK]  (value not drawn)
2  XHY-STB0603SR  [LEDC1608X80N-AK]  (value not drawn)
3  XHY-STB0603SR  [LEDC1608X80N-AK]  (value not drawn)
4  XHY-STB0603SR  [LEDC1608X80N-AK]  (value not drawn)
5  XHY-STB0603SR  [LEDC1608X80N-AK]  (value not drawn)
6  XHY-STB0603SR  [LEDC1608X80N-AK]  (value not drawn)
7  XHY-STB0603SR  [LEDC1608X80N-AK]  (value not drawn)
8  XHY-STB0603SR  [LEDC1608X80N-AK]  (value not drawn)
9  XHY-STB0603SR  [LEDC1608X80N-AK]  (value not drawn)
10  XHY-STB0603SR  [LEDC1608X80N-AK]  (value not drawn)
11  XHY-STB0603SR  [LEDC1608X80N-AK]  (value not drawn)
12  XHY-STB0603SR  [LEDC1608X80N-AK]  (value not drawn)
13  XHY-STB0603SR  [LEDC1608X80N-AK]  (value not drawn)
14  XHY-STB0603SR  [LEDC1608X80N-AK]  (value not drawn)
15  XHY-STB0603SR  [LEDC1608X80N-AK]  (value not drawn)
16  XHY-STB0603SR  [LEDC1608X80N-AK]  (value not drawn)
17  XHY-STB0603SR  [LEDC1608X80N-AK]  (value not drawn)
18  XHY-STB0603SR  [LEDC1608X80N-AK]  (value not drawn)
19  XHY-STB0603SR  [LEDC1608X80N-AK]  (value not drawn)
20  XHY-STB0603SR  [LEDC1608X80N-AK]  (value not drawn)
21  XHY-STB0603SR  [LEDC1608X80N-AK]  (value not drawn)
22  XHY-STB0603SR  [LEDC1608X80N-AK]  (value not drawn)
23  XHY-STB0603SR  [LEDC1608X80N-AK]  (value not drawn)
24  XHY-STB0603SR  [LEDC1608X80N-AK]  (value not drawn)
25  XHY-STB0603SR  [LEDC1608X80N-AK]  (value not drawn)
26  XHY-STB0603SR  [LEDC1608X80N-AK]  (value not drawn)
27  XHY-STB0603SR  [LEDC1608X80N-AK]  (value not drawn)
28  XHY-STB0603SR  [LEDC1608X80N-AK]  (value not drawn)
29  XHY-STB0603SR  [LEDC1608X80N-AK]  (value not drawn)
30  XHY-STB0603SR  [LEDC1608X80N-AK]  (value not drawn)
31  XHY-STB0603SR  [LEDC1608X80N-AK]  (value not drawn)
32  XHY-STB0603SR  [LEDC1608X80N-AK]  (value not drawn)
33  XHY-STB0603SR  [LEDC1608X80N-AK]  (value not drawn)
34  XHY-STB0603SR  [LEDC1608X80N-AK]  (value not drawn)
35  XHY-STB0603SR  [LEDC1608X80N-AK]  (value not drawn)
36  XHY-STB0603SR  [LEDC1608X80N-AK]  (value not drawn)
37  XHY-STB0603SR  [LEDC1608X80N-AK]  (value not drawn)
38  XHY-STB0603SR  [LEDC1608X80N-AK]  (value not drawn)
39  XHY-STB0603SR  [LEDC1608X80N-AK]  (value not drawn)
40  XHY-STB0603SR  [LEDC1608X80N-AK]  (value not drawn)
41  XHY-STB0603SR  [LEDC1608X80N-AK]  (value not drawn)
42  XHY-STB0603SR  [LEDC1608X80N-AK]  (value not drawn)
43  XHY-STB0603SR  [LEDC1608X80N-AK]  (value not drawn)
44  XHY-STB0603SR  [LEDC1608X80N-AK]  (value not drawn)
45  XHY-STB0603SR  [LEDC1608X80N-AK]  (value not drawn)
46  XHY-STB0603SR  [LEDC1608X80N-AK]  (value not drawn)
47  XHY-STB0603SR  [LEDC1608X80N-AK]  (value not drawn)
48  XHY-STB0603SR  [LEDC1608X80N-AK]  (value not drawn)
49  XHY-STB0603SR  [LEDC1608X80N-AK]  (value not drawn)
50  XHY-STB0603SR  [LEDC1608X80N-AK]  (value not drawn)
51  XHY-STB0603SR  [LEDC1608X80N-AK]  (value not drawn)
52  XHY-STB0603SR  [LEDC1608X80N-AK]  (value not drawn)
53  XHY-STB0603SR  [LEDC1608X80N-AK]  (value not drawn)
54  XHY-STB0603SR  [LEDC1608X80N-AK]  (value not drawn)
55  XHY-STB0603SR  [LEDC1608X80N-AK]  (value not drawn)
56  XHY-STB0603SR  [LEDC1608X80N-AK]  (value not drawn)
57  XHY-STB0603SR  [LEDC1608X80N-AK]  (value not drawn)
58  XHY-STB0603SR  [LEDC1608X80N-AK]  (value not drawn)
59  XHY-STB0603SR  [LEDC1608X80N-AK]  (value not drawn)
60  XHY-STB0603SR  [LEDC1608X80N-AK]  (value not drawn)
61  XHY-STB0603SR  [LEDC1608X80N-AK]  (value not drawn)
62  XHY-STB0603SR  [LEDC1608X80N-AK]  (value not drawn)
63  XHY-STB0603SR  [LEDC1608X80N-AK]  (value not drawn)
64  XHY-STB0603SR  [LEDC1608X80N-AK]  (value not drawn)
65  XHY-STB0603SR  [LEDC1608X80N-AK]  (value not drawn)
66  XHY-STB0603SR  [LEDC1608X80N-AK]  (value not drawn)
67  XHY-STB0603SR  [LEDC1608X80N-AK]  (value not drawn)
68  XHY-STB0603SR  [LEDC1608X80N-AK]  (value not drawn)
69  XHY-STB0603SR  [LEDC1608X80N-AK]  (value not drawn)
70  XHY-STB0603SR  [LEDC1608X80N-AK]  (value not drawn)
71  XHY-STB0603SR  [LEDC1608X80N-AK]  (value not drawn)
72  XHY-STB0603SR  [LEDC1608X80N-AK]  (value not drawn)
73  XHY-STB0603SR  [LEDC1608X80N-AK]  (value not drawn)
74  XHY-STB0603SR  [LEDC1608X80N-AK]  (value not drawn)
75  XHY-STB0603SR  [LEDC1608X80N-AK]  (value not drawn)
76  XHY-STB0603SR  [LEDC1608X80N-AK]  (value not drawn)
77  XHY-STB0603SR  [LEDC1608X80N-AK]  (value not drawn)
78  XHY-STB0603SR  [LEDC1608X80N-AK]  (value not drawn)
79  XHY-STB0603SR  [LEDC1608X80N-AK]  (value not drawn)
80  XHY-STB0603SR  [LEDC1608X80N-AK]  (value not drawn)
81  XHY-STB0603SR  [LEDC1608X80N-AK]  (value not drawn)
82  XHY-STB0603SR  [LEDC1608X80N-AK]  (value not drawn)
83  XHY-STB0603SR  [LEDC1608X80N-AK]  (value not drawn)
84  XHY-STB0603SR  [LEDC1608X80N-AK]  (value not drawn)
85  XHY-STB0603SR  [LEDC1608X80N-AK]  (value not drawn)
86  XHY-STB0603SR  [LEDC1608X80N-AK]  (value not drawn)
87  XHY-STB0603SR  [LEDC1608X80N-AK]  (value not drawn)
88  XHY-STB0603SR  [LEDC1608X80N-AK]  (value not drawn)
89  XHY-STB0603SR  [LEDC1608X80N-AK]  (value not drawn)
90  XHY-STB0603SR  [LEDC1608X80N-AK]  (value not drawn)
91  XHY-STB0603SR  [LEDC1608X80N-AK]  (value not drawn)
92  XHY-STB0603SR  [LEDC1608X80N-AK]  (value not drawn)
93  XHY-STB0603SR  [LEDC1608X80N-AK]  (value not drawn)
94  XHY-STB0603SR  [LEDC1608X80N-AK]  (value not drawn)
95  XHY-STB0603SR  [LEDC1608X80N-AK]  (value not drawn)
96  XHY-STB0603SR  [LEDC1608X80N-AK]  (value not drawn)
R2  value 330  [RES-0402]  (hidden comment: CRCW0402330RJNED)
R14  value 330  [RES-0402]  (hidden comment: CRCW0402330RJNED)
R16  value 330  [RES-0402]  (hidden comment: CRCW0402330RJNED)
R27  value 330  [RES-0402]  (hidden comment: CRCW0402330RJNED)
R28  value 330  [RES-0402]  (hidden comment: CRCW0402330RJNED)
R29  value 330  [RES-0402]  (hidden comment: CRCW0402330RJNED)
R30  value 330  [RES-0402]  (hidden comment: CRCW0402330RJNED)
R31  value 330  [RES-0402]  (hidden comment: CRCW0402330RJNED)
R32  value 330  [RES-0402]  (hidden comment: CRCW0402330RJNED)
R33  value 330  [RES-0402]  (hidden comment: CRCW0402330RJNED)
R34  value 330  [RES-0402]  (hidden comment: CRCW0402330RJNED)

### Ports
0 (in), 1 (in), 2 (in), 3 (in), 4 (in), 5 (in), 6 (in), 7 (in), 8 (in), 9 (in), 10 (in)

### Nets
P003: R27.2 ; port 0
P004: R28.2 ; port 1
P011: R29.2 ; port 2
P012: R30.2 ; port 3
P013: R31.2 ; port 4
P015: R32.2 ; port 5
P204: R33.2 ; port 6
P205: R34.2 ; port 7
P206: R2.2 ; port 8
P212: R14.2 ; port 9
P213: R16.2 ; port 10
ROW0: 1.A 2.C 3.A 4.C 7.A 8.C 13.A 14.C 21.A 22.C 31.A 32.C 43.A 44.C 57.A 58.C 73.A 74.C 91.A 92.C R34.1  [project net ROW0_2]
ROW1: 1.C 2.A 5.A 6.C 9.A 10.C 15.A 16.C 23.A 24.C 33.A 34.C 45.A 46.C 59.A 60.C 75.A 76.C 93.A 94.C R30.1  [project net ROW1_2]
ROW2: 3.C 4.A 5.C 6.A 11.A 12.C 17.A 18.C 25.A 26.C 35.A 36.C 47.A 48.C 61.A 62.C 77.A 78.C 95.A 96.C R31.1  [project net ROW2_2]
ROW3: 7.C 8.A 9.C 10.A 11.C 12.A 19.A 20.C 27.A 28.C 37.A 38.C 49.A 50.C 63.A 64.C 79.A 80.C R2.1  [project net ROW3_2]
ROW4: 13.C 14.A 15.C 16.A 17.C 18.A 19.C 20.A 29.A 30.C 39.A 40.C 51.A 52.C 65.A 66.C 81.A 82.C R27.1  [project net ROW4_2]
ROW5: 21.C 22.A 23.C 24.A 25.C 26.A 27.C 28.A 29.C 30.A 41.A 42.C 53.A 54.C 67.A 68.C 83.A 84.C R33.1  [project net ROW5_2]
ROW6: 31.C 32.A 33.C 34.A 35.C 36.A 37.C 38.A 39.C 40.A 41.C 42.A 55.A 56.C 69.A 70.C 85.A 86.C R32.1  [project net ROW6_2]
ROW7: 43.C 44.A 45.C 46.A 47.C 48.A 49.C 50.A 51.C 52.A 53.C 54.A 55.C 56.A 71.A 72.C 87.A 88.C R28.1  [project net ROW7_2]
ROW8: 57.C 58.A 59.C 60.A 61.C 62.A 63.C 64.A 65.C 66.A 67.C 68.A 69.C 70.A 71.C 72.A 89.A 90.C R29.1  [project net ROW8_2]
ROW9: 73.C 74.A 75.C 76.A 77.C 78.A 79.C 80.A 81.C 82.A 83.C 84.A 85.C 86.A 87.C 88.A 89.C 90.A R16.1  [project net ROW9_2]
ROW10: 91.C 92.A 93.C 94.A 95.C 96.A R14.1  [project net ROW10_2]

### Notes on the sheet
- 1
- 2
- 3
- 4
- 5
- 6
- 7
- 8
- 9
- 10
- 11
- 12
- 13
- 14
- 15
- 16
- 17
- 18
- 19
- 20
- 21
- 22
- 23
- 24
- 25
- 26
- 27
- 28
- 29
- 30
- 31
- 32
- 33
- 34
- 35
- 36
- 37
- 38
- 39
- 40
- 41
- 42
- 43
- 44
- 45
- 46
- 47
- 48
- 49
- 61
- 50
- 62
- 51
- 63
- 52
- 64
- 53
- 65
- 54
- 66
- 55
- 67
- 56
- 68
- 57
- 69
- 58
- 70
- 59
- 71
- 60
- 72
- 73
- 74
- 75
- 76
- 77
- 78
- 79
- 80
- 81
- 82
- 83
- 84
- 85
- 86
- 87
- 88
- 89
- 90
- 91
- 92
- 93
- 94
- 95
- 96
- Title:
- ID:
- Date:
- Time:
- Version:
- Sheet
- of
- RevAuthor:
- Reference Designs ARE PROVIDED "AS IS" AND "WITH ALL FAULTS. Arduino SA DISCLAIMS ALL OTHER WARRANTIES, EXPRESS OR IMPLIED, REGARDING PRODUCTS, INCLUDING BUT NOT LIMITED TO, ANY IMPLIED WARRANTIES OF MERCHANTABILITY OR FITNESS FOR A PARTICULAR PURPOSE.
  Arduino SA may make changes to specifications and product descriptions at any time, without notice. The Customer must not rely on the absence or characteristics of any features or instructions marked "reserved" or "undefined". Arduino SA reserves these for future definition and shall have no responsibility whatsoever for conflicts or incompatibilities arising from future changes to them. The product information on the Web Site or Materials is subject to change without notice.
  Do not finalize a design with this info. ARDUINO and other Arduino brands and logos and Trademarks of Arduino SA. All Arduino SA Trademarks cannot be used without owner's formal permission.
- File:
- Author:

### Library data of the parts
1-96 = L0024-A.4: LED SMD 0603 RED 625nm, water clear, 42 to 88 mcd, 120 degrees, 1.6x0.8x0.6mm; Manufacturer: Shenzen Corehy Technology; Code Arduino: L0024; Pin Count: 2; Part Number: XHY-STB0603SR
R2 R14 R16 R27-R34 = R0017-A.21: RES CHIP 0402 330R 5% 1/16W; Manufacturer: Vishay; Code Arduino: 2229; Power: 62.5mW; Temperature Coefficient: 200ppm; Part Number: CRCW0402330RJNED; Tolerance: 5%; Case Code (Imperial): 0402; Technology: Thick film

## Nets that join several sheets
P003: TOP (U1.61), LEDMATRIX (R27.2)
P004: TOP (U1.60), LEDMATRIX (R28.2)
P011: TOP (U1.58), LEDMATRIX (R29.2)
P012: TOP (U1.55), LEDMATRIX (R30.2)
P013: TOP (U1.54), LEDMATRIX (R31.2)
P015: TOP (U1.52), LEDMATRIX (R32.2)
P204: TOP (U1.24), LEDMATRIX (R33.2)
P205: TOP (U1.23), LEDMATRIX (R34.2)
P206: TOP (U1.22), LEDMATRIX (R2.2)
P212: TOP (U1.10), LEDMATRIX (R14.2)
P213: TOP (U1.9), LEDMATRIX (R16.2)

## Assembly variants
ABX00087: not fitted C1 C22 C23 R4 R5 R8 R21 R37 R41 R53 R54 R55 R56